# Altium schematic sheet LCD_1.47_172_320_2022-03-14.schdoc
size 52 x 55 mm
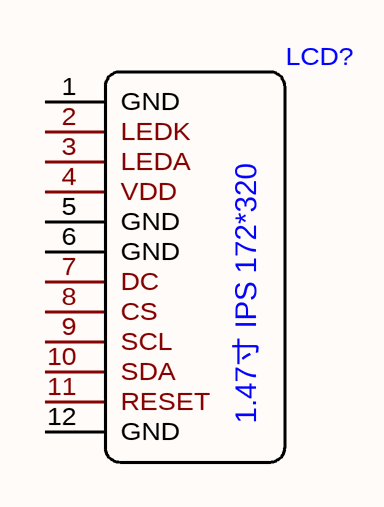
[diagram p0: LCD_1.47_172_320_2022-03-14.schdoc]

## Parts
LCD?  (no value)  [LCD_1.47_172*320_TOP]

## Nets

Not connected (* = marked no-connect by the designer): LCD? 1(GND) 2(LEDK) 3(LEDA) 4(VDD) 5(GND) 6(GND) 7(DC) 8(CS) 9(SCL) 10(SDA) 11(RESET) 12(GND)

## Notes on the sheet
- (in symbol LCD_1.47_172*320) 1.47寸 IPS 172*320

## Library data of the parts
LCD? = LCD_1.47_172*320